# Altium schematic sheet FPGA_USB2AER.SchDoc
size A4
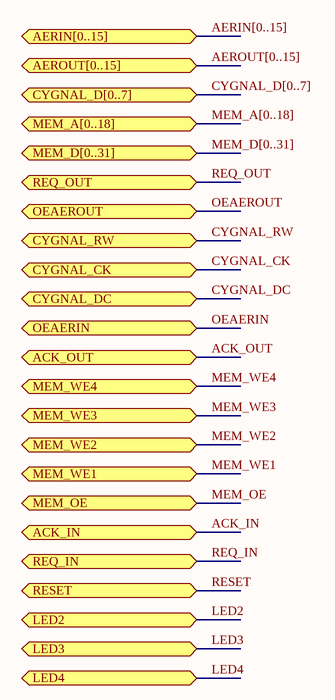
[diagram p0: FPGA_USB2AER.SchDoc]

## Ports
ACK_IN (bidir), ACK_OUT (bidir), AERIN[0..15] (bidir), AEROUT[0..15] (bidir), CYGNAL_CK (bidir), CYGNAL_D[0..7] (bidir), CYGNAL_DC (bidir), CYGNAL_RW (bidir), LED2 (bidir), LED3 (bidir), LED4 (bidir), MEM_A[0..18] (bidir), MEM_D[0..31] (bidir), MEM_OE (bidir), MEM_WE1 (bidir), MEM_WE2 (bidir), MEM_WE3 (bidir), MEM_WE4 (bidir), OEAERIN (bidir), OEAEROUT (bidir), REQ_IN (bidir), REQ_OUT (bidir), RESET (bidir)

## Nets
ACK_IN: port ACK_IN
ACK_OUT: port ACK_OUT
CYGNAL_CK: port CYGNAL_CK
CYGNAL_DC: port CYGNAL_DC
CYGNAL_RW: port CYGNAL_RW
LED2: port LED2
LED3: port LED3
LED4: port LED4
MEM_OE: port MEM_OE
MEM_WE1: port MEM_WE1
MEM_WE2: port MEM_WE2
MEM_WE3: port MEM_WE3
MEM_WE4: port MEM_WE4
OEAERIN: port OEAERIN
OEAEROUT: port OEAEROUT
REQ_IN: port REQ_IN
REQ_OUT: port REQ_OUT
RESET: port RESET

## Buses and harness runs
bus AERIN[0..15] = port AERIN[0..15]
bus AEROUT[0..15] = port AEROUT[0..15]
bus CYGNAL_D[0..7] = port CYGNAL_D[0..7]
bus MEM_A[0..18] = port MEM_A[0..18]
bus MEM_D[0..31] = port MEM_D[0..31]